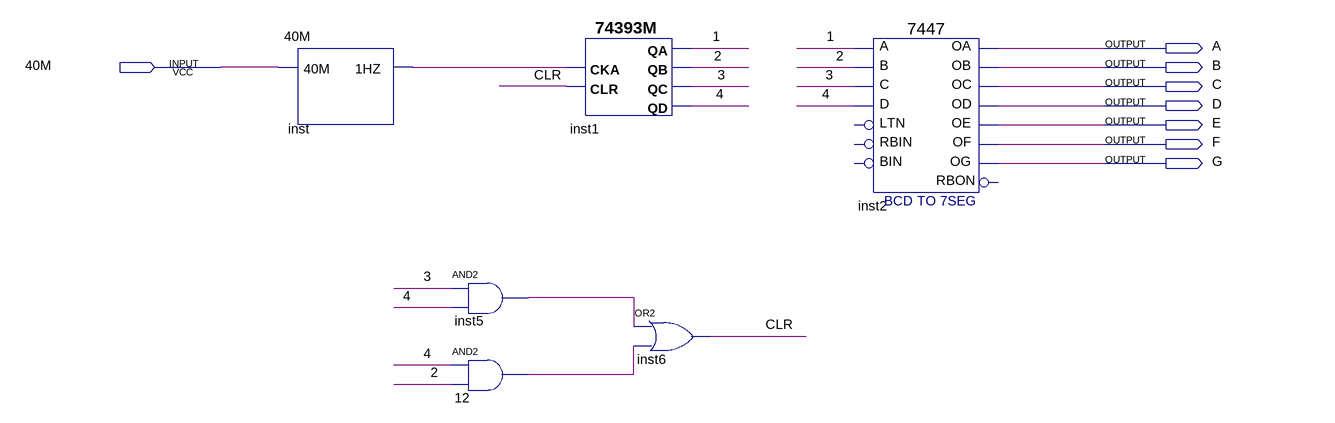
[diagram p0: schematic sheet]
// Quartus schematic 2.bdf as structural Verilog: 6 symbols, 8 pins
module \2  (
  input  \40M ,
  output A,
  output B,
  output C,
  output D,
  output E,
  output F,
  output G
);

  wire \1 , \2 , \3 , \4 , CLR, inst5_out, inst_1hz, n12_out;

  \40M  inst (.\40M (\40M ), .\1HZ (inst_1hz));
  and inst5 (inst5_out, \3 , \4 );
  and u_12 (n12_out, \4 , \2 );
  \74393M  inst1 (.CLR(CLR), .CKA(inst_1hz), .QC(\3 ), .QD(\4 ), .QB(\2 ), .QA(\1 ));
  or inst6 (CLR, inst5_out, n12_out);
  \7447  inst2 (
    .B(\2 ), .C(\3 ), .D(\4 ), .A(\1 ), .OB(B), .OC(C), .OE(E), .OD(D), .OF(F), .OG(G), .OA(A));  // open: LTN, RBIN, BIN, RBON
endmodule
